# Altium schematic sheet Sheet1.SchDoc
size A
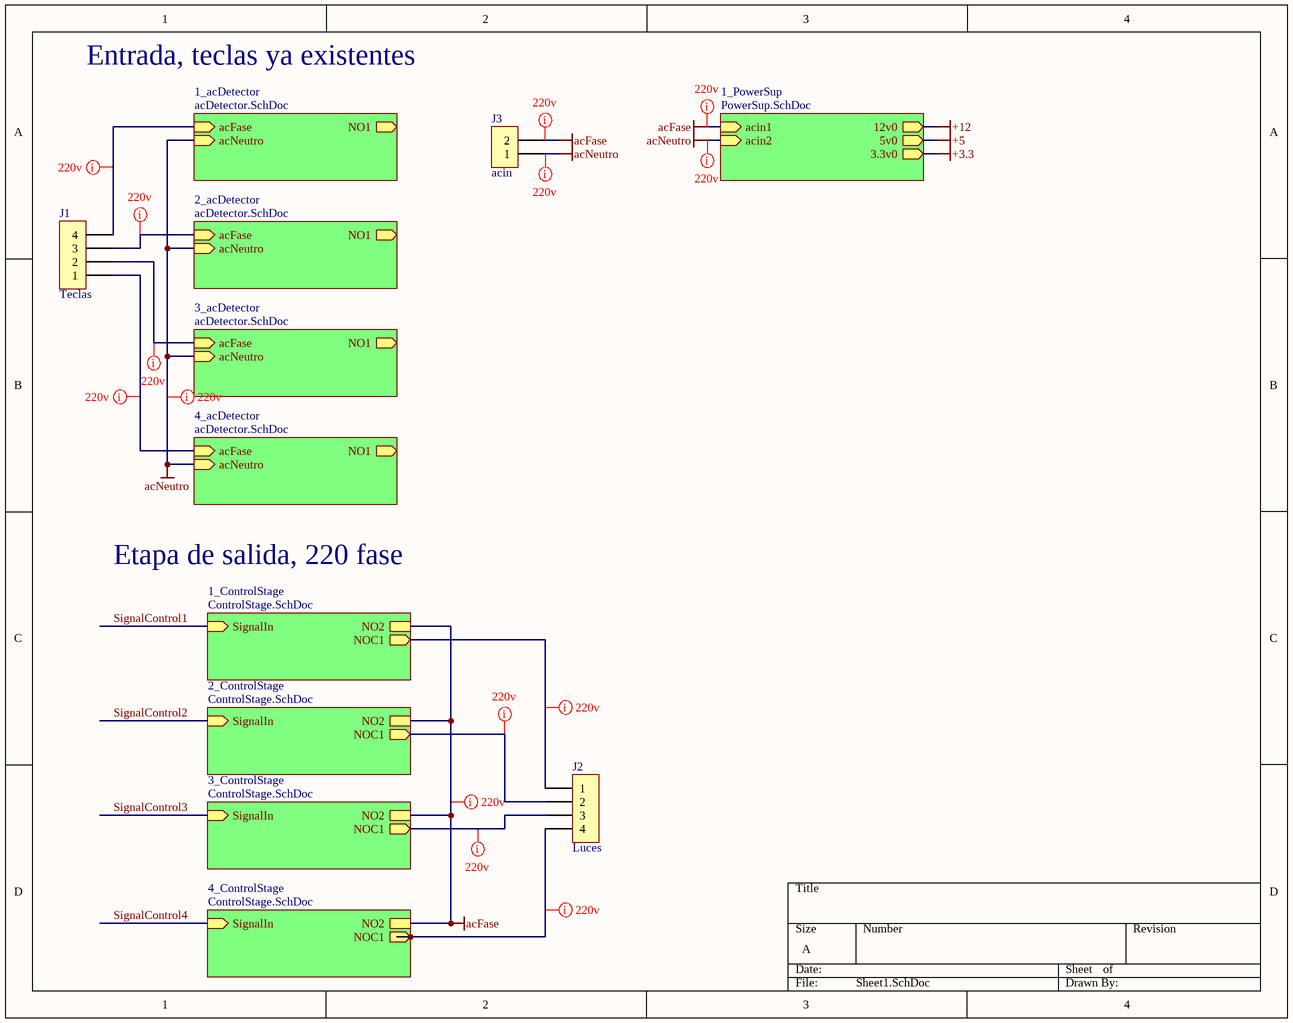
[diagram p0: Sheet1.SchDoc]

## Parts
J1  Teclas  [BORNERA4]
J2  Luces  [BORNERA4]
J3  acin  [BORNERA2]

## Sub-sheets
1_acDetector = acDetector.SchDoc: acFase (in), acNeutro (in), NO1 (out)
1_ControlStage = ControlStage.SchDoc: SignalIn (in), NO2, NOC1 (out)
1_PowerSup = PowerSup.SchDoc: 12v0 (out), 5v0 (out), 3.3v0 (out), acin1 (in), acin2 (in)
2_acDetector = acDetector.SchDoc: acFase (in), acNeutro (in), NO1 (out)
2_ControlStage = ControlStage.SchDoc: SignalIn (in), NO2, NOC1 (out)
3_acDetector = acDetector.SchDoc: acFase (in), acNeutro (in), NO1 (out)
3_ControlStage = ControlStage.SchDoc: SignalIn (in), NO2, NOC1 (out)
4_acDetector = acDetector.SchDoc: acFase (in), acNeutro (in), NO1 (out)
4_ControlStage = ControlStage.SchDoc: SignalIn (in), NO2, NOC1 (out)

## Nets
+3.3: sheet 1_PowerSup/3.3v0
+5: sheet 1_PowerSup/5v0
+12: sheet 1_PowerSup/12v0
acFase: J3.2 ; sheet 1_ControlStage/NO2, sheet 2_ControlStage/NO2, sheet 3_ControlStage/NO2, sheet 4_ControlStage/NO2, sheet 1_PowerSup/acin1
acNeutro: J3.1 ; sheet 1_acDetector/acNeutro, sheet 2_acDetector/acNeutro, sheet 3_acDetector/acNeutro, sheet 4_acDetector/acNeutro, sheet 1_PowerSup/acin2
SignalControl1: sheet 1_ControlStage/SignalIn
SignalControl2: sheet 2_ControlStage/SignalIn
SignalControl3: sheet 3_ControlStage/SignalIn
SignalControl4: sheet 4_ControlStage/SignalIn
NetJ1_1: J1.1 ; sheet 4_acDetector/acFase
NetJ1_2: J1.2 ; sheet 3_acDetector/acFase
NetJ1_3: J1.3 ; sheet 2_acDetector/acFase
NetJ1_4: J1.4 ; sheet 1_acDetector/acFase
NetJ2_1: J2.1 ; sheet 1_ControlStage/NOC1
NetJ2_2: J2.2 ; sheet 2_ControlStage/NOC1
NetJ2_3: J2.3 ; sheet 3_ControlStage/NOC1
NetJ2_4: J2.4 ; sheet 4_ControlStage/NOC1

## Layout directives
mark named 220v: acFase, acNeutro, NetJ1_1, NetJ1_2, NetJ1_3, NetJ1_4, NetJ2_1, NetJ2_2, NetJ2_3, NetJ2_4

## Notes on the sheet
- Entrada, teclas ya existentes
- Etapa de salida, 220 fase

## Library data of the parts
J1 J2 = BORNERA 4
J3 = BORNERA 2